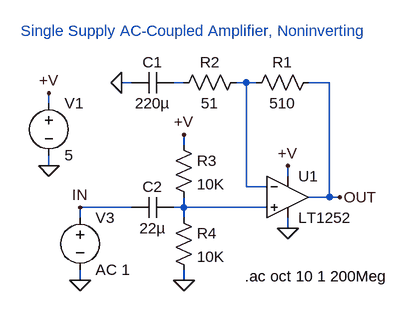
[diagram p0: schematic 1252.asc]
1252.asc, the LTspice schematic file:
Version 4
SHEET 1 896 680
WIRE -48 64 -64 64
WIRE 32 64 16 64
WIRE 128 64 112 64
WIRE 144 64 128 64
WIRE 256 64 224 64
WIRE -176 96 -176 80
WIRE 32 160 32 144
WIRE -176 192 -176 176
WIRE 192 208 192 192
WIRE 128 224 128 64
WIRE 160 224 128 224
WIRE 256 240 256 64
WIRE 256 240 224 240
WIRE 272 240 256 240
WIRE -48 256 -128 256
WIRE 32 256 32 240
WIRE 32 256 16 256
WIRE 160 256 32 256
WIRE -128 272 -128 256
WIRE 32 272 32 256
WIRE 192 288 192 272
WIRE -128 368 -128 352
WIRE 32 368 32 352
FLAG -176 192 0
FLAG 192 192 +V
FLAG -176 80 +V
FLAG -64 64 0
FLAG -128 368 0
FLAG 32 368 0
FLAG 32 144 +V
FLAG 192 288 0
FLAG 272 240 OUT
FLAG -128 256 IN
SYMBOL voltage -176 80 R0
SYMATTR InstName V1
SYMATTR Value 5
SYMBOL res 240 48 R90
WINDOW 0 0 56 VBottom 0
WINDOW 3 32 56 VTop 0
SYMATTR InstName R1
SYMATTR Value 510
SYMBOL res 128 48 R90
WINDOW 0 0 56 VBottom 0
WINDOW 3 32 56 VTop 0
SYMATTR InstName R2
SYMATTR Value 51
SYMBOL voltage -128 256 R0
SYMATTR InstName V3
SYMATTR Value AC 1
SYMBOL opamps\\LT1252 192 176 R0
SYMATTR InstName U1
SYMBOL cap 16 48 R90
WINDOW 0 0 32 VBottom 0
WINDOW 3 32 32 VTop 0
SYMATTR InstName C1
SYMATTR Value 220µ
SYMBOL res 16 144 R0
SYMATTR InstName R3
SYMATTR Value 10K
SYMBOL res 16 256 R0
SYMATTR InstName R4
SYMATTR Value 10K
SYMBOL cap 16 240 R90
WINDOW 0 0 32 VBottom 0
WINDOW 3 32 32 VTop 0
SYMATTR InstName C2
SYMATTR Value 22µ
TEXT 126 362 Left 0 !.ac oct 10 1 200Meg
TEXT 48 0 Bottom 0 ;Single Supply AC-Coupled Amplifier, Noninverting

The netlist it stands for:
* 1252.asc
V1 +V 0 5
R1 OUT N002 510
R2 N002 N001 51
V3 IN 0 AC 1
XU1 N003 N002 +V 0 OUT LT1252  ; pins In+ In- V+ V- OUT
C1 N001 0 220µ
R3 +V N003 10K
R4 N003 0 10K
C2 N003 IN 22µ
.ac oct 10 1 200Meg
* Single Supply AC-Coupled Amplifier, Noninverting
.backanno
.end